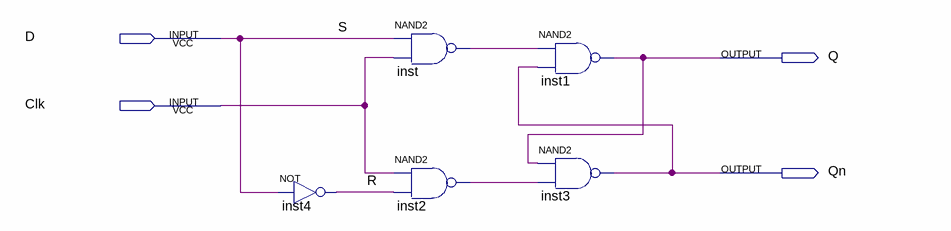
[diagram p0: schematic sheet]
// Quartus schematic lab9step3.bdf as structural Verilog: 5 symbols, 4 pins
module lab9step3 (
  input  D,
  input  Clk,
  output Q,
  output Qn
);

  wire inst2_out, inst_out, R;

  not inst4 (R, D);
  nand inst (inst_out, D, Clk);
  nand inst2 (inst2_out, Clk, R);
  nand inst1 (Q, inst_out, Qn);
  nand inst3 (Qn, Q, inst2_out);

  // Other names for the same wires on the sheet: S = D
endmodule
